# EAGLE schematic sd1_redraw (EAGLE 8.5.1)
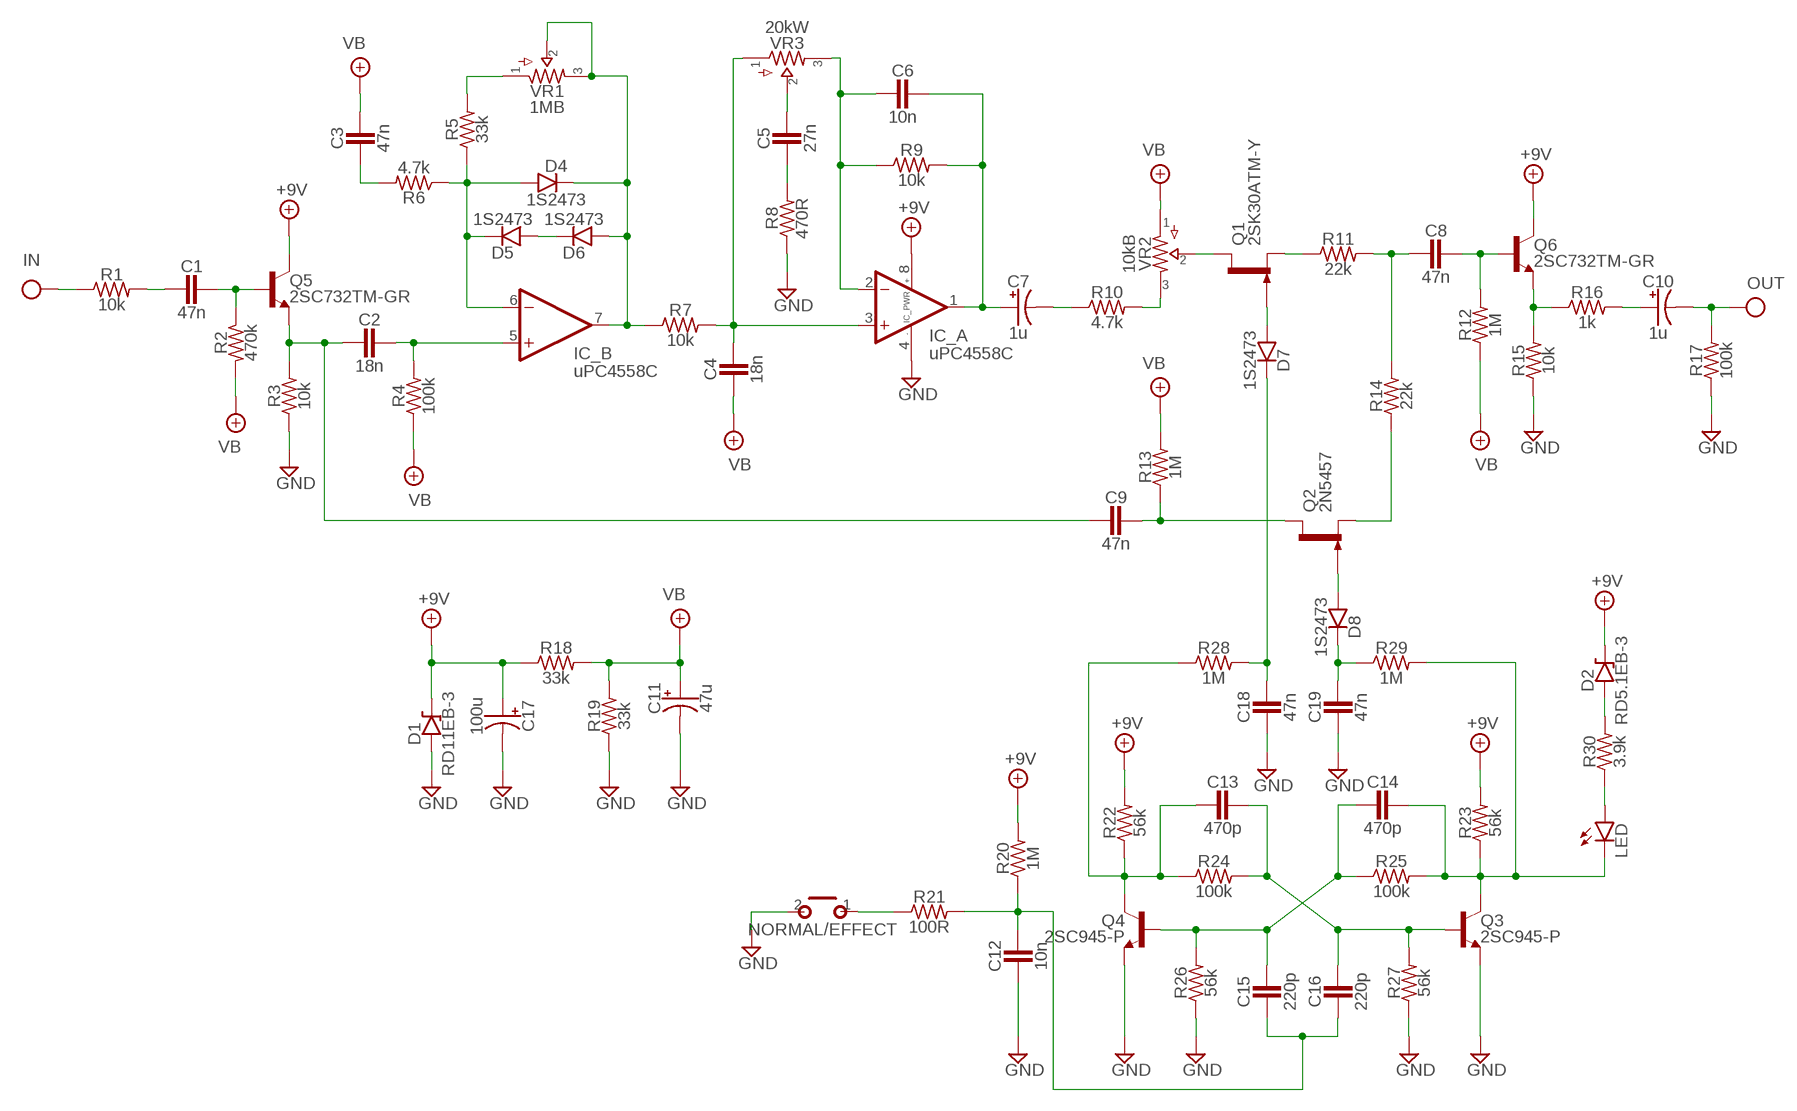
[diagram p0: schematic, sheet 1]

## Parts
C1  47n  CER/FILMBOX.1  [BOX_SMALL]
C2  18n  CER/FILMBOX.1  [BOX_SMALL]
C3  47n  CER/FILMBOX.1  [BOX_SMALL]
C4  18n  CER/FILMBOX.1  [BOX_SMALL]
C5  27n  CER/FILMBOX.1  [BOX_SMALL]
C6  10n  CER/FILMBOX.1  [BOX_SMALL]
C7  1u  0400  [040_020]
C8  47n  CER/FILMBOX.1  [BOX_SMALL]
C9  47n  CER/FILMBOX.1  [BOX_SMALL]
C10  1u  0400  [040_020]
C11  47u  0400  [040_020]
C12  10n  CER/FILMBOX.1  [BOX_SMALL]
C13  470p  CER/FILMBOX.1  [BOX_SMALL]
C14  470p  CER/FILMBOX.1  [BOX_SMALL]
C15  220p  CER/FILMBOX.1  [BOX_SMALL]
C16  220p  CER/FILMBOX.1  [BOX_SMALL]
C17  100u  0400  [040_020]
C18  47n  CER/FILMBOX.1  [BOX_SMALL]
C19  47n  CER/FILMBOX.1  [BOX_SMALL]
D1  RD11EB-3  ZENER.2  [DO41-2]
D2  RD5.1EB-3  ZENER.2  [DO41-2]
D4  1S2473  DO35.2  [DO35-2]
D5  1S2473  DO35.2  [DO35-2]
D6  1S2473  DO35.2  [DO35-2]
D7  1S2473  DO35.2  [DO35-2]
D8  1S2473  DO35.2  [DO35-2]
IC  uPC4558C  DUALTH  [DIL0]
LED  SLP1358  LED  [3MM_D]
NORMAL/EFFECT  MOMENTARY  [SPST]
Q1  2SK30ATM-Y  2N5457  [TO92-]
Q2  2N5457  [TO92-]
Q3  2SC945-P  2SC828A  [TO92-]
Q4  2SC945-P  2SC828A  [TO92-]
Q5  2SC732TM-GR  2SC828A  [TO92-]
Q6  2SC732TM-GR  2SC828A  [TO92-]
R1  10k  R_.3B  [R0207/3]
R2  470k  R_.3B  [R0207/3]
R3  10k  R_.3B  [R0207/3]
R4  100k  R_.3B  [R0207/3]
R5  33k  R_.3B  [R0207/3]
R6  4.7k  R_.3B  [R0207/3]
R7  10k  R_.3B  [R0207/3]
R8  470R  R_.3B  [R0207/3]
R9  10k  R_.3B  [R0207/3]
R10  4.7k  R_.3B  [R0207/3]
R11  22k  R_.3B  [R0207/3]
R12  1M  R_.3B  [R0207/3]
R13  1M  R_.3B  [R0207/3]
R14  22k  R_.3B  [R0207/3]
R15  10k  R_.3B  [R0207/3]
R16  1k  R_.3B  [R0207/3]
R17  100k  R_.3B  [R0207/3]
R18  33k  R_.3B  [R0207/3]
R19  33k  R_.3B  [R0207/3]
R20  1M  R_.3B  [R0207/3]
R21  100R  R_.3B  [R0207/3]
R22  56k  R_.3B  [R0207/3]
R23  56k  R_.3B  [R0207/3]
R24  100k  R_.3B  [R0207/3]
R25  100k  R_.3B  [R0207/3]
R26  56k  R_.3B  [R0207/3]
R27  56k  R_.3B  [R0207/3]
R28  1M  R_.3B  [R0207/3]
R29  1M  R_.3B  [R0207/3]
R30  3.9k  R_.3B  [R0207/3]
VR1  1MB  POTS16MM  [16MM]
VR2  10kB  POTS16MM  [16MM]
VR3  20kW  POTS16MM  [16MM]

## Nets
+9V: C17.+ D1.C D2.C IC.8(_PWR:V+) Q5.2(C) Q6.2(C) R18.1 R20.2 R22.2 R23.2
GND: C11.- C12.2 C17.- C18.2 C19.2 D1.A IC.4(_PWR:V-) NORMAL/EFFECT.2(S) Q3.3(E) Q4.3(E) R3.1 R8.1 R15.1 R17.1 R19.1 R26.1 R27.1
IN: R1.1
N$1: Q1.3(D) VR2.2
N$3: C1.2 R1.2
N$4: C1.1 Q5.1(B) R2.1
N$5: D4.A D5.C IC.6(_B:-IN) R5.1 R6.1
N$7: C2.2 C9.2 Q5.3(E) R3.2
N$8: C2.1 IC.5(_B:+IN) R4.2
N$9: C3.2 R6.2
N$10: D5.A D6.C
N$11: D4.C D6.A IC.7(_B:OUT) R7.1 VR1.2 VR1.3
N$12: R5.2 VR1.1
N$13: C4.1 IC.3(_A:+IN) R7.2 VR3.1
N$14: C6.2 IC.2(_A:-IN) R9.1 VR3.3
N$15: C6.1 C7.+ IC.1(_A:OUT) R9.2
N$16: C5.1 VR3.2
N$17: C5.2 R8.2
N$18: C7.- R10.1
N$19: R10.2 VR2.3
N$21: Q1.2(S) R11.1
N$22: C8.2 R11.2 R14.2
N$23: C8.1 Q6.1(B) R12.2
N$24: Q6.3(E) R15.2 R16.1
N$25: C10.+ R16.2
N$29: C13.2 Q4.2(C) R22.1 R24.1 R28.1
N$31: C14.1 LED.P$1(C) Q3.2(C) R23.1 R25.2 R29.2
N$32: C14.2 C15.1 Q4.1(B) R25.1 R26.2
N$33: Q2.2(S) R14.1
N$34: C13.1 C16.1 Q3.1(B) R24.2 R27.2
N$35: C18.1 D7.C R28.2
N$36: C12.1 C15.2 C16.2 R20.1 R21.2
N$37: C19.1 D8.C R29.1
N$38: NORMAL/EFFECT.1(P) R21.1
N$39: D8.A Q2.1(G)
N$40: D7.A Q1.1(G)
N$41: C9.1 Q2.3(D) R13.1
N$42: LED.ANODE(A) R30.1
N$43: D2.A R30.2
OUT: C10.- R17.2
VB: C3.1 C4.2 C11.+ R2.2 R4.1 R12.1 R13.2 R18.2 R19.2 VR2.1

## Library data of the parts
C1-C6 C8 C9 C12-C16 C18 C19 = pedals-capacitors-film:CER/FILM: 47 - 120pF Xicon Ceramic Disc 2.5mm lead spacing
C7 C10 C11 C17 = pedals-capacitors-elec:040
D1 D2 = pedals-diodes:ZENER
D4-D8 = pedals-diodes:DO35: DO-35 Package Diodes: 1N914
IC = pedals-integrated circuits:DUAL: OP AMP
LED = pedals-diodes:LED
NORMAL/EFFECT = pedals-switches:MOMENTARY
Q1 Q2 = pedals-transistors:2N5457: N-CHANNEL JFET
Q3-Q6 = pedals-transistors:2SC828A
R1-R30 = pedals-resistors:R_
VR1-VR3 = pedals-potentiometers:POTS